# EAGLE design Electrode_Shield (EAGLE 5.06)
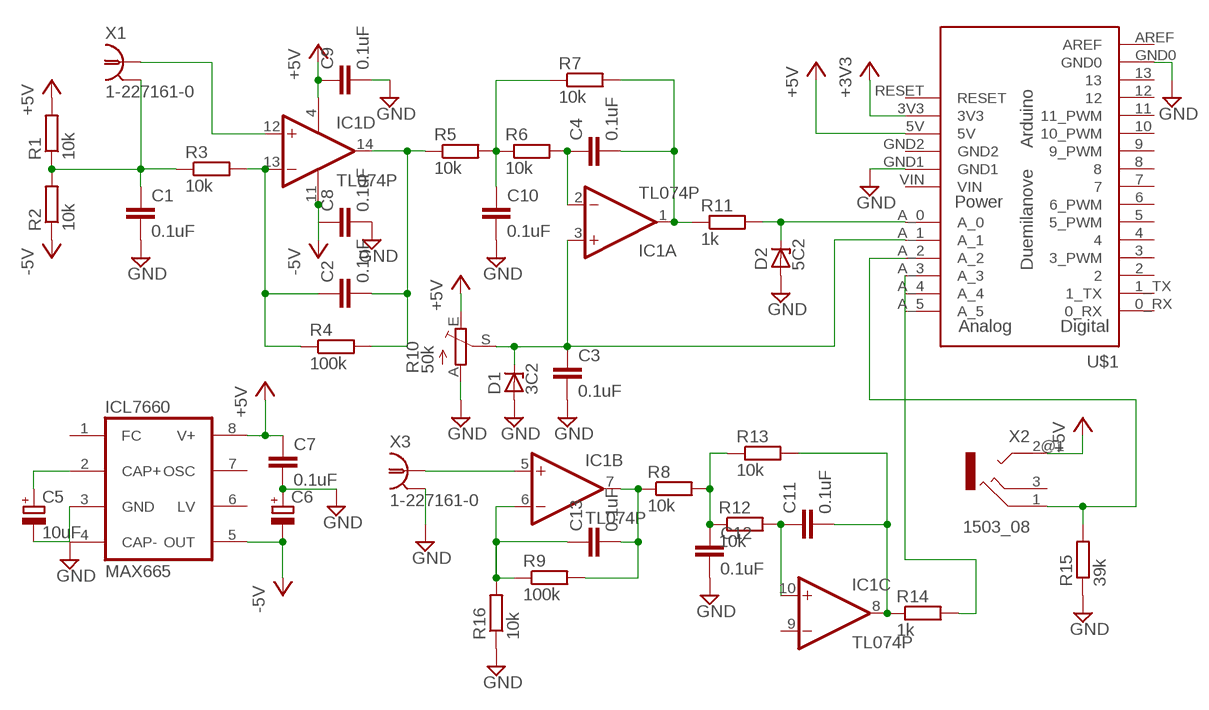
[diagram p0: schematic, sheet 1]

## Parts
C1  0.1uF  C2.5/2  [C2.5-2]
C2  0.1uF  C2.5/2  [C2.5-2]
C3  0.1uF  C2.5/2  [C2.5-2]
C4  0.1uF  C2.5/2  [C2.5-2]
C5  10uF  CPOL-EUE2-4  [E2-4]
C6  CPOL-EUE2-4  [E2-4]
C7  0.1uF  C2.5/2  [C2.5-2]
C8  0.1uF  C2.5/2  [C2.5-2]
C9  0.1uF  C2.5/2  [C2.5-2]
C10  0.1uF  C2.5/2  [C2.5-2]
C11  0.1uF  C2.5/2  [C2.5-2]
C12  0.1uF  C2.5/2  [C2.5-2]
C13  0.1uF  C2.5/2  [C2.5-2]
D1  3C2  ZENER-DIODEDO34-7  [DO34Z7]
D2  5C2  ZENER-DIODEDO34-7  [DO34Z7]
IC1  TL074P  [DIL14]
ICL7660  MAX665  [DIL08]
R1  10k  R-EU_0204/5  [0204/5]
R2  10k  R-EU_0204/5  [0204/5]
R3  10k  R-EU_0204/5  [0204/5]
R4  100k  R-EU_0204/5  [0204/5]
R5  10k  R-EU_0204/5  [0204/5]
R6  10k  R-EU_0204/5  [0204/5]
R7  10k  R-EU_0204/5  [0204/5]
R8  10k  R-EU_0204/5  [0204/5]
R9  100k  R-EU_0204/5  [0204/5]
R10  50k  TRIM_EU-B64Y  [B64Y]
R11  1k  R-EU_0204/5  [0204/5]
R12  10k  R-EU_0204/5  [0204/5]
R13  10k  R-EU_0204/5  [0204/5]
R14  1k  R-EU_0204/5  [0204/5]
R15  39k  R-EU_0204/5  [0204/5]
R16  10k  R-EU_0204/5  [0204/5]
U$1  ARDUINO-USBOCTAGONAL_PADS  [SHIELD-OCTAGONALPAD]
X1  1-227161-0  [AMP_227161]
X2  1503_08  [1503_08]
X3  1-227161-0  [AMP_227161]

## Nets
+3V3: U$1.3V3
+5V: C7.1 C9.1 IC1.4(P:V+) ICL7660.8(V+) R1.2 R10.E U$1.5V X2.2@1
-5V: C6.- C8.1 IC1.11(P:V-) ICL7660.5(OUT) R2.1
GND: C1.2 C3.2 C6.+ C7.2 C8.2 C9.2 C10.2 C12.2 D1.A D2.A ICL7660.3(GND) R10.A R15.1 R16.1 U$1.GND0 U$1.GND1 X3.2(GND)
N$1: C1.1 R1.1 R2.2 R3.1 X1.2(GND)
N$2: C2.1 IC1.13(D:-IN) R3.2 R4.1
N$3: C2.2 IC1.14(D:OUT) R4.2 R5.1
N$4: IC1.12(D:+IN) X1.1
N$5: C5.- ICL7660.4(CAP-)
N$6: C4.1 IC1.2(A:-IN) R6.2
N$7: C4.2 IC1.1(A:OUT) R7.2 R11.1
N$8: C13.2 IC1.7(B:OUT) R8.1 R9.2
N$9: C13.1 R16.2
N$10: C3.1 D1.C IC1.3(A:+IN) R10.S U$1.A_1
N$11: D2.C R11.2 U$1.A_0
N$12: C5.+ ICL7660.2(CAP+)
N$13: C10.1 R5.2 R6.1 R7.1
N$14: C11.1 IC1.10(C:+IN) R12.2
N$15: C12.1 R8.2 R12.1 R13.1
N$16: C11.2 IC1.8(C:OUT) R13.2 R14.1
N$17: R9.1
N$18: IC1.5(B:+IN) X3.1
N$19: R15.2 U$1.A_2 X2.1
N$20: R14.2 U$1.A_3
Unconnected: IC1.6(B:-IN) IC1.9(C:-IN) ICL7660.1(FC) ICL7660.6(LV) ICL7660.7(OSC) U$1.0_RX U$1.1_TX U$1.2 U$1.3(3_PWM) U$1.4 U$1.5(5_PWM) U$1.6(6_PWM) U$1.7 U$1.8 U$1.9(9_PWM) U$1.10(10_PWM) U$1.11(11_PWM) U$1.12 U$1.13 U$1.A_4 U$1.A_5 U$1.AREF U$1.GND2 U$1.RESET X2.2@2 X2.3

## Power pins joined to a net without a drawn wire
VIN: U$1.VIN

## Library data of the parts
C1-C4 C7-C13 = capacitor-wima:C: CAPACITOR naming: grid - package width
C5 C6 = rcl:CPOL-EU: POLARIZED CAPACITOR, European symbol
D1 D2 = diode:ZENER-DIODE: Z-Diode
IC1 = linear:TL074: OP AMP
ICL7660 = maxim:MAX665: Switched-capcitor VOLTAGE CONVERTER
R1-R9 R11-R16 = rcl:R-EU_: RESISTOR, European symbol
R10 = pot:TRIM_EU-: POTENTIOMETER
U$1 = Arduino-Various:ARDUINO-USB: The Ardiuno Duemilanove Pinouts layoutet as a Bare Shield. v0.5 Also for Arduino Diecimila. This is designed as a Part and has no Outline in the Dimension Layer. The Outline, when present, is drawed at the tPlace / bPlace Layer. Library by Stephanie Lange, http://www.k-ita.de/~sl/
X1 X3 = con-coax:?227161*: JACK, RIGHT ANGLE, 50 OHM, PCB, BNC Source: amp_227161.pdf
X2 = con-lumberg:1503_?: Jack connectors according to JISC 6560, 3.5 mm Klinkensteckverbinder nach JISC 6560, 3,5 mm Source: http://www.lumberg.com/Produkte/PDFs/1503_08.pdf

## Board
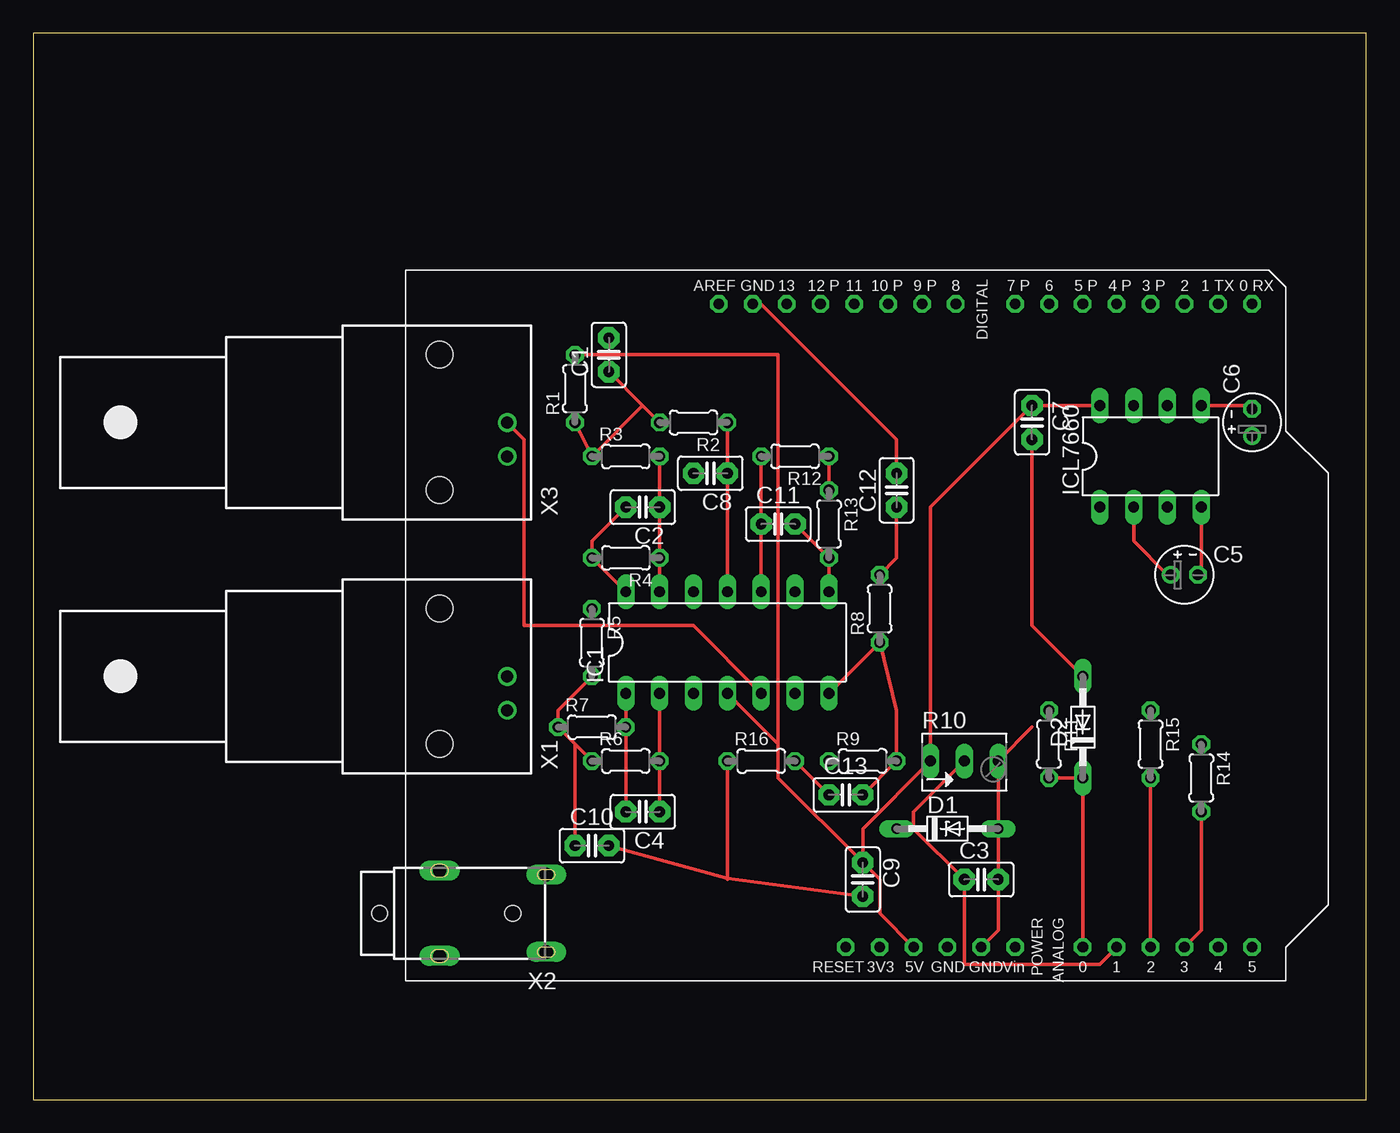
[diagram p1: board, top side]
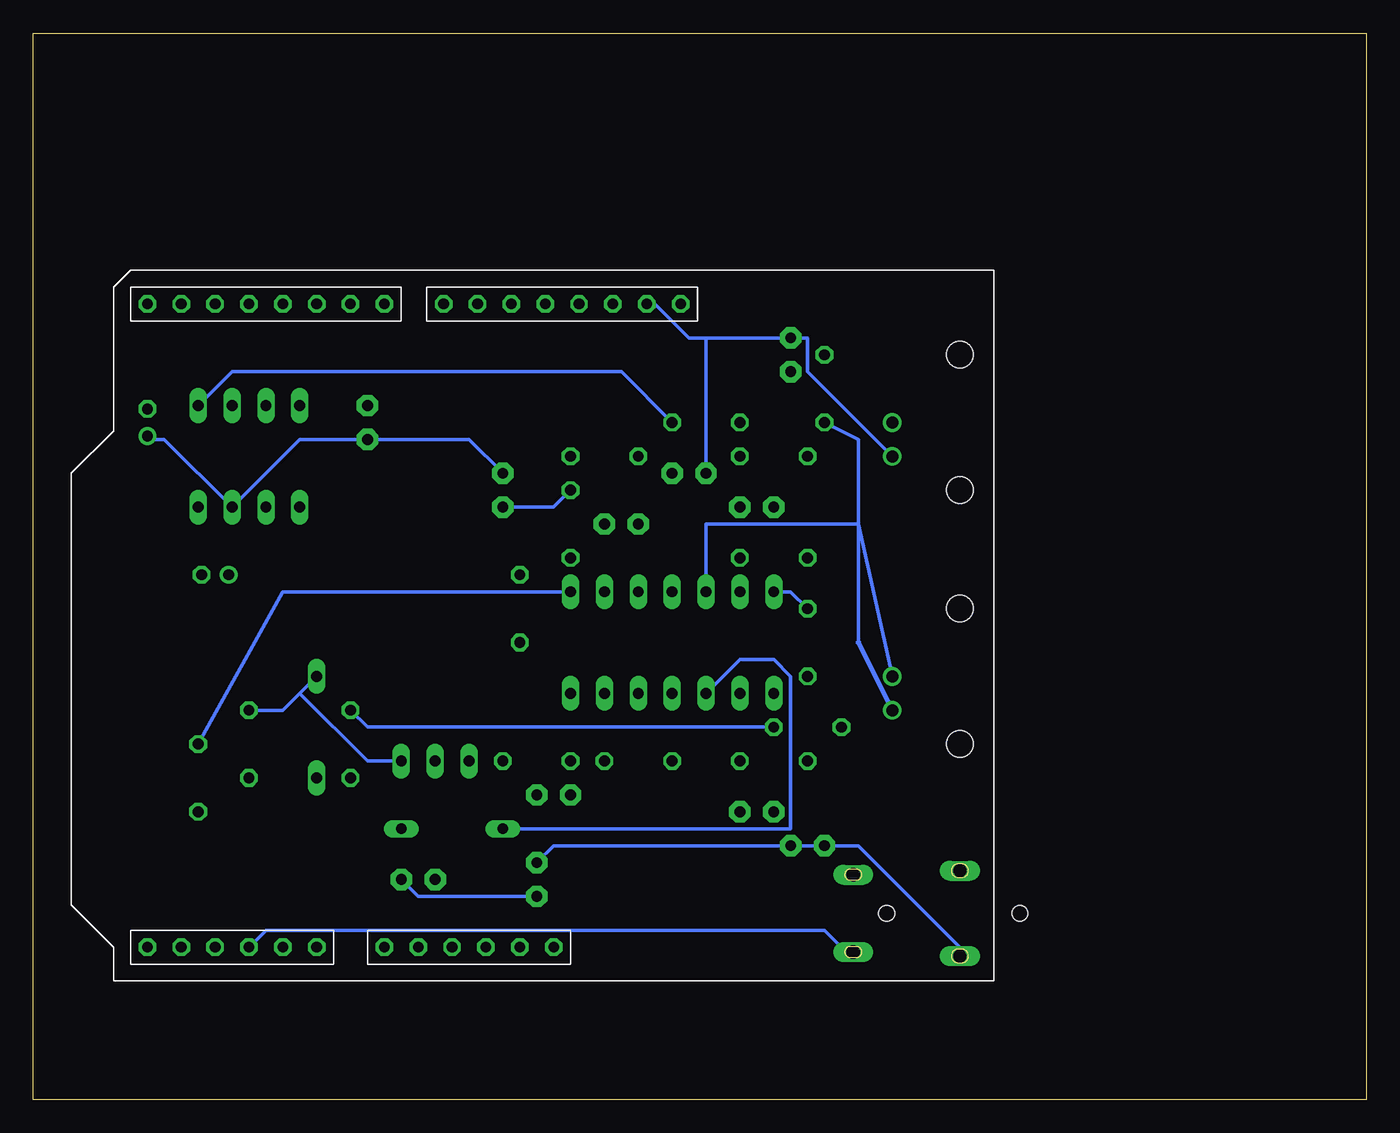
[diagram p2: board, bottom side, seen from below]

Size 100 x 80 mm. Coordinates in mm from the lower left corner, seen from the top.
Outline: 0,0 100,0 100,80 0,80 0,0
Copper layers (1*16): Top 0.035mm / dielectric 1.5mm / Bottom 0.035mm
Design rules "default": minimum track width 10mil, minimum drill 24mil, track to track 8mil, track to pad 8mil, pad to pad 8mil, via to via 8mil, smd to smd 8mil, copper to edge 40mil, drill to drill 8mil, minimum pad ring 10mil, minimum via ring 8mil, stop-mask expansion 4mil, vias tented up to drill 0mil, thermal gap 10mil

### Footprints (pad centres in the part's own frame; a part is rotated, then mirrored left to right if it is on the bottom)
C2.5-2 = drill 0.813 pad 1.6 octagon: 1 -1.27,0; 2 1.27,0
E2-4 = drill 0.813 pad 1.27 round: + -1.016,0 | drill 0.813 pad 1.27 octagon: - 1.016,0
DO34Z7 = drill 0.813 long: A 3.81,0; C -3.81,0
DIL14 = drill 0.813 long: 1 -7.62,-3.81; 2 -5.08,-3.81; 3 -2.54,-3.81; 4 0,-3.81; 5 2.54,-3.81; 6 5.08,-3.81; 7 7.62,-3.81; 8 7.62,3.81; 9 5.08,3.81; 10 2.54,3.81; 11 0,3.81; 12 -2.54,3.81; 13 -5.08,3.81; 14 -7.62,3.81
DIL08 = drill 0.813 long: 1 -3.81,-3.81; 2 -1.27,-3.81; 3 1.27,-3.81; 4 3.81,-3.81; 5 3.81,3.81; 6 1.27,3.81; 7 -1.27,3.81; 8 -3.81,3.81
0204/5 = drill 0.813 octagon: 1 -2.54,0; 2 2.54,0
B64Y = drill 0.813 long: A 2.54,0; E -2.54,0; S 0,0
SHIELD-OCTAGONALPAD = drill 0.8 pad 1.27 octagon: 0_RX -25.4,27.94; 1_TX -25.4,25.4; 2 -25.4,22.86; 3 -25.4,20.32; 3V3 22.86,0; 4 -25.4,17.78; 5 -25.4,15.24; 5V 22.86,2.54; 6 -25.4,12.7; 7 -25.4,10.16; 8 -25.4,5.715; 9 -25.4,3.175; 10 -25.4,0.635; 11 -25.4,-1.905; 12 -25.4,-4.445; 13 -25.4,-6.985; A_0 22.86,15.24; A_1 22.86,17.78; A_2 22.86,20.32; A_3 22.86,22.86; A_4 22.86,25.4; A_5 22.86,27.94; AREF -25.4,-12.065; GND0 -25.4,-9.525; GND1 22.86,7.62; GND2 22.86,5.08; RESET 22.86,-2.54; VIN 22.86,10.16
AMP_227161 = drill 0.9 pad 1.27 round: 1 0,-5.08; 2 -2.54,-5.08 | hole 2: -5.08,0; 5.08,0
1503_08 = drill 1 pad 1.2 long: 1 -2.9,-8; 2@1 -3.2,0; 2@2 3.2,0; 3 2.9,-8 | hole 1.2: 0,4.5; 0,-5.5

### Placement (x,y rotation side)
C1  43.18,55.88 90 top
C2  45.72,44.45 180 top
C3  71.12,16.51 0 top
C4  45.72,21.59 180 top
C5  86.36,39.37 0 top
C6  91.44,50.8 90 top
C7  74.93,50.8 270 top
C8  50.8,46.99 180 top
C9  62.23,16.51 270 top
C10  41.91,19.05 0 top
C11  55.88,43.18 0 top
C12  64.77,45.72 90 top
C13  60.96,22.86 0 top
D1  68.58,20.32 0 top
D2  78.74,27.94 90 top
IC1  52.07,34.29 0 top
ICL7660  83.82,48.26 0 top
R1  40.64,53.34 90 top
R2  49.53,50.8 180 top
R3  44.45,48.26 0 top
R4  44.45,40.64 180 top
R5  41.91,34.29 270 top
R6  44.45,25.4 0 top
R7  41.91,27.94 0 top
R8  63.5,36.83 90 top
R9  62.23,25.4 0 top
R10  69.85,25.4 0 top
R11  76.2,26.67 270 top
R12  57.15,48.26 180 top
R13  59.69,43.18 270 top
R14  87.63,24.13 270 top
R15  83.82,26.67 270 top
R16  54.61,25.4 0 top
U$1  63.5,34.29 270 top
X1  30.48,31.75 90 top
X2  30.48,13.97 90 top
X3  30.48,50.8 90 top

### Tracks (layer width: path | path; a pad name or v marks a point on that pad's centre or on a via)
+5V
  Top 0.254: U$1.5V 63.5,13.97 63.5,16.51 C9.1 | C9.1 62.23,20.32 R10.E 67.31,44.45 C7.1 ICL7660.8 | 55.88,26.67 IC1.4 | 55.88,26.67 55.88,24.13 C9.1 | R1.2 55.88,55.88 55.88,26.67
  Bottom 0.254: C9.1 60.96,19.05 38.1,19.05 30.48,11.43 X2.2@1
-5V
  Top 0.254: ICL7660.5 91.44,52.07 C6.- | IC1.11 C8.1 R2.1
  Bottom 0.254: ICL7660.5 85.09,54.61 55.88,54.61 R2.1
GND
  Top 0.254: U$1.GND1 72.39,12.7 C3.2 D1.A R10.A 74.93,27.94 | C10.2 52.08,16.59 | 52.08,16.59 C9.2 | R16.1 52.07,16.51 52.08,16.59 | C12.2 64.77,49.53 54.61,59.69 U$1.GND0 | D2.A 74.93,35.56 C7.2
  Bottom 0.254: C3.2 71.12,15.24 C9.2 | 80.01,30.48 81.28,29.21 R15.1 | 80.01,30.48 D2.A | 80.01,30.48 74.93,25.4 R10.A | 49.53,57.15 C1.2 41.91,57.15 41.91,54.61 X3.2 | 49.53,57.15 50.8,57.15 53.34,59.69 U$1.GND0 | 49.53,57.15 C8.2 | C6.+ 91.44,49.53 90.17,49.53 ICL7660.3 80.01,49.53 C7.2 67.31,49.53 C12.2
N$1
  Top 0.254: R1.1 R3.1 45.72,52.07 | 45.72,52.07 C1.1 | 45.72,52.07 R2.2
  Bottom 0.254: R1.1 38.1,49.53 38.1,34.29
  Bottom 0.406: X1.2 38.1,34.29
N$2
  Top 0.254: IC1.13 R4.1 C2.1 R3.2
N$3
  Top 0.254: C2.2 41.91,41.91 R4.2 IC1.14
  Bottom 0.254: R5.1 43.18,38.1 IC1.14
N$4
  Bottom 0.254: IC1.12 49.53,43.18 38.1,43.18 X1.1
N$5
  Top 0.254: ICL7660.4 87.63,39.37 C5.-
N$6
  Top 0.254: IC1.2 R6.2 C4.1
N$7
  Top 0.254: IC1.1 R7.2 C4.2
  Bottom 0.254: R11.1 74.93,27.94 R7.2
N$8
  Top 0.254: IC1.7 R8.1 64.77,29.21 R9.2 C13.2
N$9
  Top 0.254: R16.2 C13.1
N$10
  Top 0.254: R10.S 66.04,21.59 66.04,20.32 | 66.04,20.32 C3.1 69.85,10.16 80.01,10.16 U$1.A_1 | D1.C 66.04,20.32
  Bottom 0.254: IC1.3 46.99,33.02 44.45,33.02 43.18,31.75 43.18,20.32 D1.C
N$11
  Top 0.254: U$1.A_0 D2.C R11.2
N$12
  Top 0.254: ICL7660.2 82.55,41.91 85.09,39.37 C5.+
N$13
  Top 0.254: 40.64,26.67 R6.1 | 40.64,26.67 R7.1 39.37,29.21 R5.2 | C10.1 40.64,26.67
N$14
  Top 0.254: IC1.10 R12.2 C11.1
N$15
  Top 0.254: R13.1 R12.1 | R8.2 64.77,40.64 C12.1
  Bottom 0.254: R13.1 60.96,44.45 C12.1
N$16
  Top 0.254: IC1.8 R13.2 C11.2
  Bottom 0.254: R14.1 81.28,38.1 IC1.8
N$18
  Top 0.254: IC1.5 49.53,35.56 36.83,35.56 36.83,49.53 X3.1
N$19
  Top 0.254: U$1.A_2 R15.2
  Bottom 0.254: U$1.A_2 82.55,12.7 40.64,12.7 39.37,11.43 X2.1
N$20
  Top 0.254: U$1.A_3 87.63,12.7 R14.2